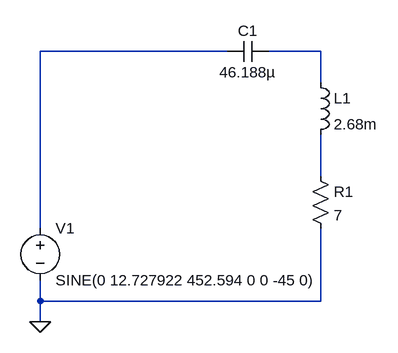
[diagram p0: schematic scheme6.asc]
scheme6.asc, the LTspice schematic file:
Version 4
SHEET 1 880 680
WIRE 448 -144 160 -144
WIRE 592 -144 512 -144
WIRE 592 -96 592 -144
WIRE 592 48 592 -16
WIRE 160 128 160 -144
WIRE 160 240 160 208
WIRE 592 240 592 128
WIRE 592 240 160 240
WIRE 160 272 160 240
FLAG 160 272 0
SYMBOL voltage 160 112 R0
WINDOW 123 0 0 Left 0
WINDOW 39 0 0 Left 0
SYMATTR InstName V1
SYMATTR Value SINE(0 12.727922 452.594 0 0 -45 0)
SYMBOL res 576 32 R0
SYMATTR InstName R1
SYMATTR Value 7
SYMBOL cap 512 -160 R90
WINDOW 0 0 32 VBottom 2
WINDOW 3 32 32 VTop 2
SYMATTR InstName C1
SYMATTR Value 46.188µ
SYMBOL ind 576 -112 R0
SYMATTR InstName L1
SYMATTR Value 2.68m

The netlist it stands for:
* scheme6.asc
V1 N001 0 SINE(0 12.727922 452.594 0 0 -45 0)
R1 N003 0 7
C1 N002 N001 46.188µ
L1 N002 N003 2.68m
.backanno
.end